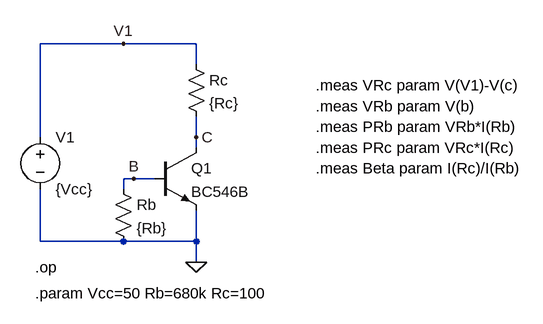
[diagram p0: schematic TBJ01b.asc]
TBJ01b.asc, the LTspice schematic file:
Version 4
SHEET 1 984 680
WIRE 256 -32 128 -32
WIRE 368 -32 256 -32
WIRE 368 0 368 -32
WIRE 128 112 128 -32
WIRE 368 112 368 80
WIRE 368 128 368 112
WIRE 272 176 256 176
WIRE 304 176 272 176
WIRE 256 192 256 176
WIRE 128 272 128 192
WIRE 256 272 128 272
WIRE 368 272 368 224
WIRE 368 272 256 272
WIRE 368 304 368 272
FLAG 368 304 0
FLAG 272 176 B
FLAG 368 112 C
FLAG 256 -32 V1
SYMBOL voltage 128 96 R0
WINDOW 123 0 0 Left 0
WINDOW 39 0 0 Left 0
SYMATTR InstName V1
SYMATTR Value {Vcc}
SYMBOL res 240 176 R0
SYMATTR InstName Rb
SYMATTR Value {Rb}
SYMBOL res 352 -16 R0
SYMATTR InstName Rc
SYMATTR Value {Rc}
SYMBOL npn 304 128 R0
SYMATTR InstName Q1
SYMATTR Value BC546B
TEXT 120 312 Left 2 !.op
TEXT 120 352 Left 2 !.param Vcc=50 Rb=680k Rc=100
TEXT 552 32 Left 2 !.meas VRc param V(V1)-V(c)
TEXT 552 64 Left 2 !.meas VRb param V(b)
TEXT 552 96 Left 2 !.meas PRb param VRb*I(Rb)
TEXT 552 128 Left 2 !.meas PRc param VRc*I(Rc)
TEXT 552 160 Left 2 !.meas Beta param I(Rc)/I(Rb)

The netlist it stands for:
* TBJ01b.asc
V1 V1 0 {Vcc}
Rb B 0 {Rb}
Rc V1 C {Rc}
Q1 C B 0 0 BC546B
.model NPN NPN
.model PNP PNP
.lib standard.bjt
.op
.param Vcc=50 Rb=680k Rc=100
.meas VRc param V(V1)-V(c)
.meas VRb param V(b)
.meas PRb param VRb*I(Rb)
.meas PRc param VRc*I(Rc)
.meas Beta param I(Rc)/I(Rb)
.backanno
.end